# Altium schematic sheet CellsVoltMeasurementSensor.SchDoc
size A3; SheetNumber: 1; SheetTotal: 4
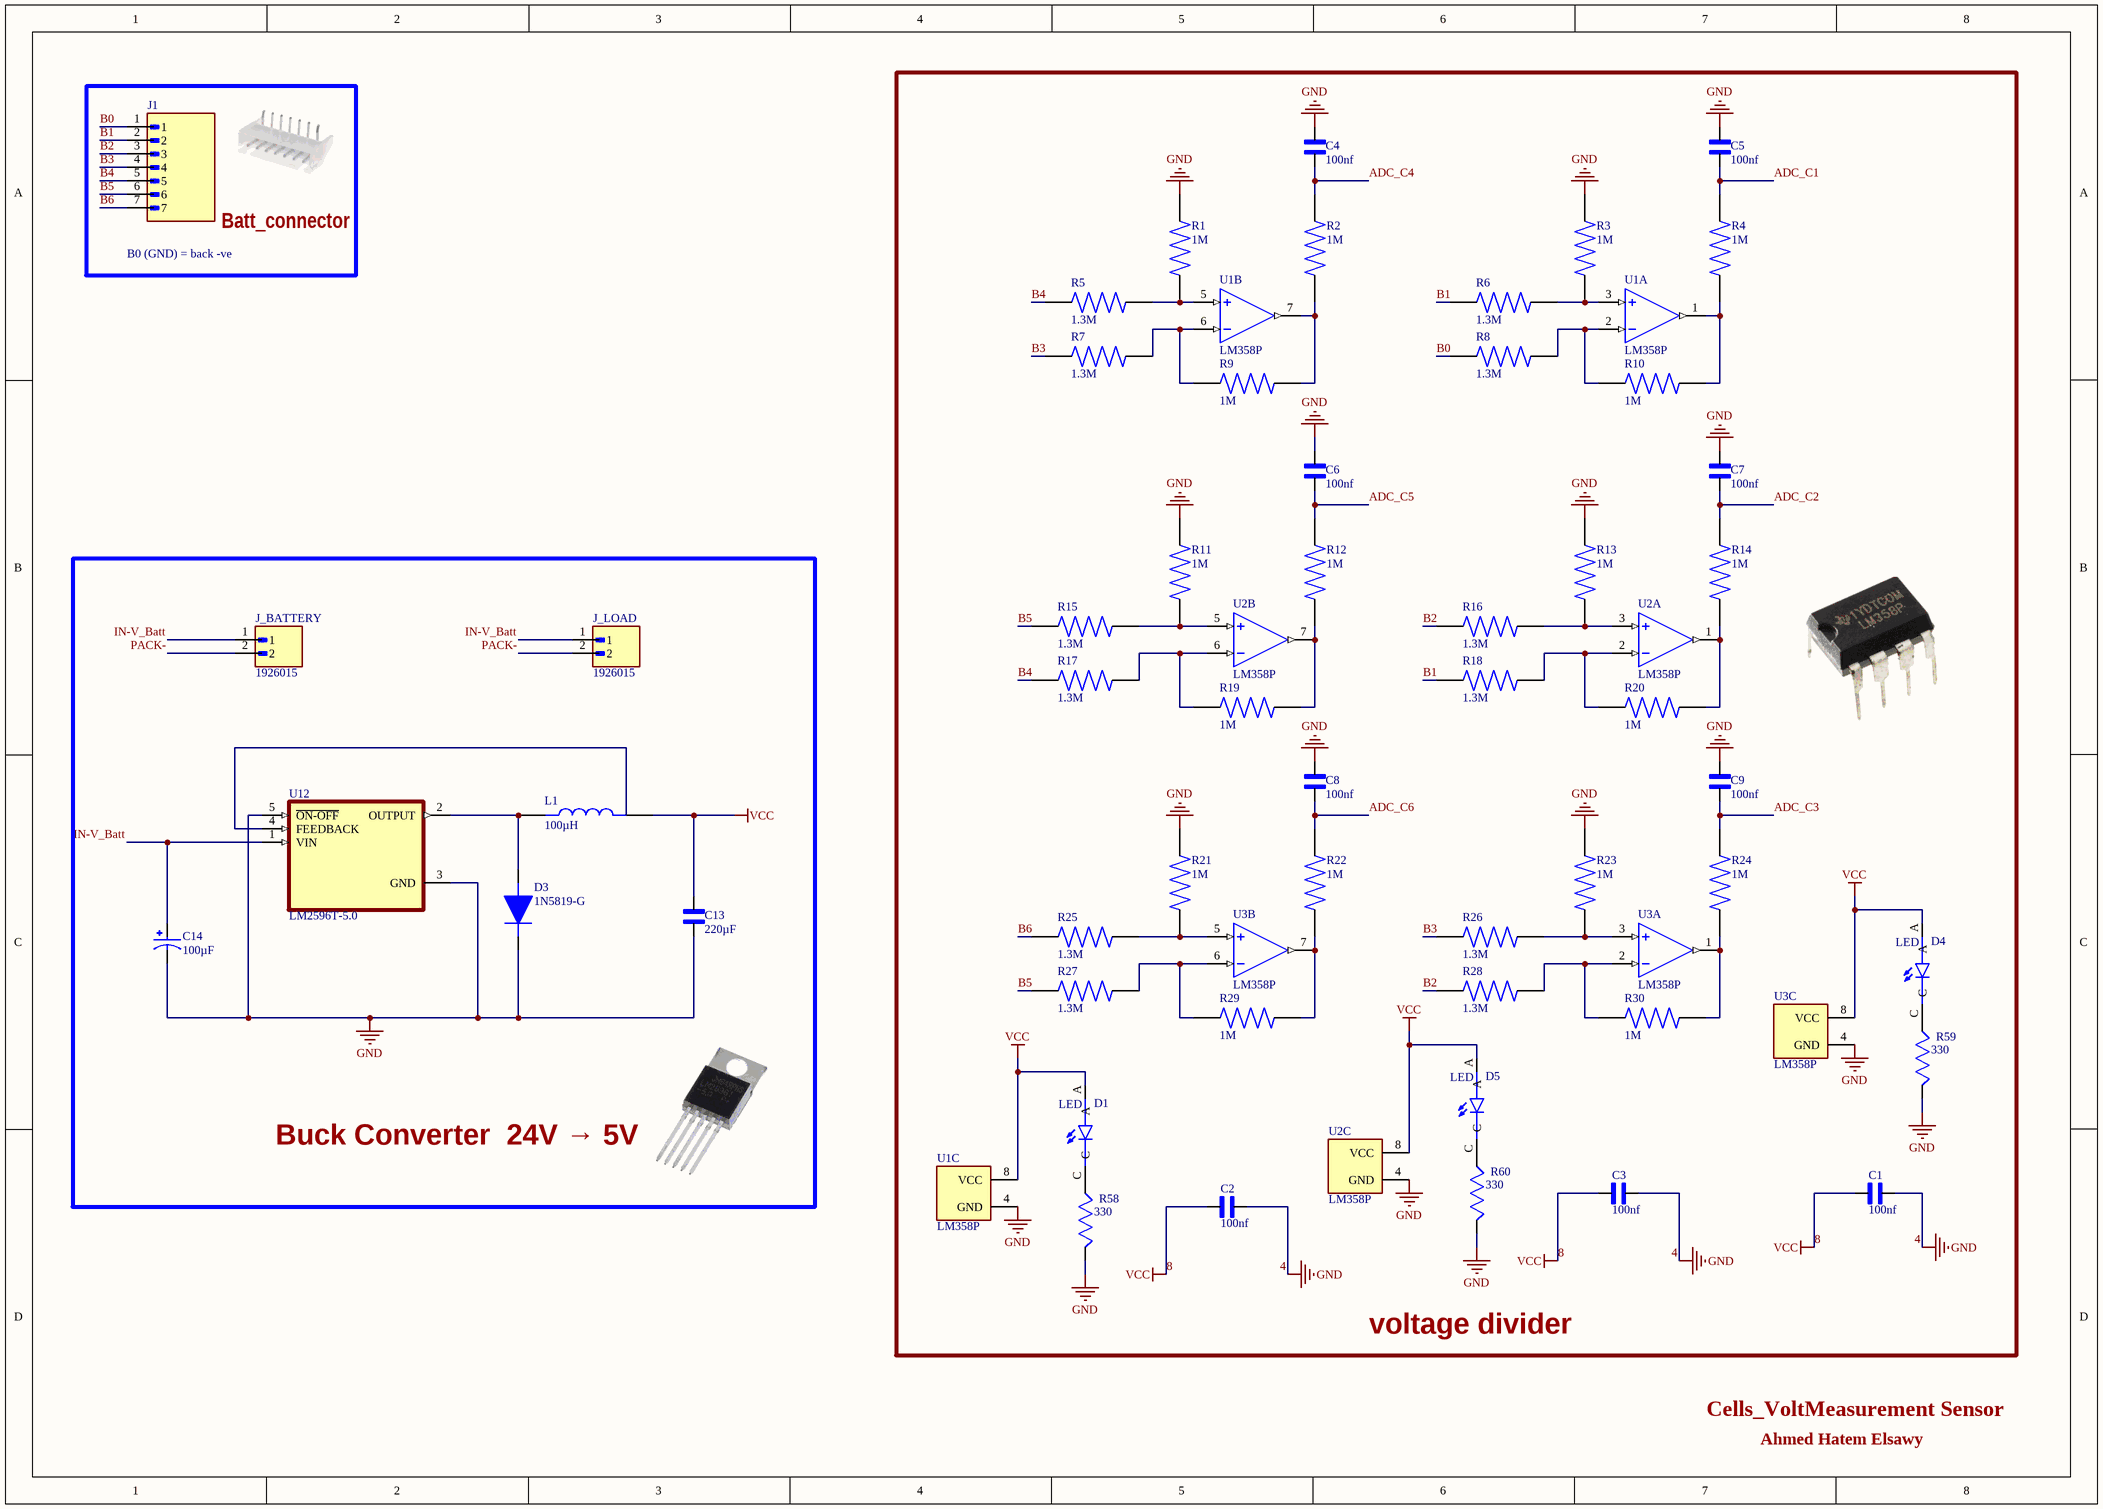
[diagram p0: CellsVoltMeasurementSensor.SchDoc]

## Parts
C1  100nf  [CAPC1608X90N]
C2  100nf  [CAPC1608X90N]
C3  100nf  [CAPC1608X90N]
C4  100nf  [CAPC1608X90N]
C5  100nf  [CAPC1608X90N]
C6  100nf  [CAPC1608X90N]
C7  100nf  [CAPC1608X90N]
C8  100nf  [CAPC1608X90N]
C9  100nf  [CAPC1608X90N]
C13  220µF  [CAPPM7343X310N]
C14  100µF  [CAP_EEEFN1E101UP]
D1  LED  [LED_WP7113ID]
D3  1N5819-G  [DIOAD1405W75L465D235]
D4  LED  [LED_WP7113ID]
D5  LED  [LED_WP7113ID]
J1  S7B-XH-A(LF)(SN)  [JST_S7B-XH-A(LF)(SN)]  (value not drawn)
J_BATTERY  1926015  [PHOENIX_1926015]
J_LOAD  1926015  [PHOENIX_1926015]
L1  100µH  [INDC2012X145N]
R1  1M  [RESC3216X75N]
R2  1M  [RESC3216X75N]
R3  1M  [RESC3216X75N]
R4  1M  [RESC3216X75N]
R5  1.3M  [RESC5025X70N]
R6  1.3M  [RESC5025X70N]
R7  1.3M  [RESC5025X70N]
R8  1.3M  [RESC5025X70N]
R9  1M  [RESC3216X75N]
R10  1M  [RESC3216X75N]
R11  1M  [RESC3216X75N]
R12  1M  [RESC3216X75N]
R13  1M  [RESC3216X75N]
R14  1M  [RESC3216X75N]
R15  1.3M  [RESC5025X70N]
R16  1.3M  [RESC5025X70N]
R17  1.3M  [RESC5025X70N]
R18  1.3M  [RESC5025X70N]
R19  1M  [RESC3216X75N]
R20  1M  [RESC3216X75N]
R21  1M  [RESC3216X75N]
R22  1M  [RESC3216X75N]
R23  1M  [RESC3216X75N]
R24  1M  [RESC3216X75N]
R25  1.3M  [RESC5025X70N]
R26  1.3M  [RESC5025X70N]
R27  1.3M  [RESC5025X70N]
R28  1.3M  [RESC5025X70N]
R29  1M  [RESC3216X75N]
R30  1M  [RESC3216X75N]
R58  330  [RESC3216X65]
R59  330  [RESC3216X65]
R60  330  [RESC3216X65]
U1  LM358P  [DIP794W45P254L959H508Q8]  (parts A,B,C of 3)
U2  LM358P  [DIP794W45P254L959H508Q8]  (parts A,B,C of 3)
U3  LM358P  [DIP794W45P254L959H508Q8]  (parts A,B,C of 3)
U12  LM2596T-5.0  [TO170P1016X470X2092-5]

## Blocks framed on the sheet
Batt_connector: J1
voltage divider: C1-C9 D1 D4 D5 R1-R30 R58-R60 U1-U3
Buck Converter  24V → 5V: C13 C14 D3 J_BATTERY J_LOAD L1 U12

## Nets
4: C1.1 C2.1 C3.1 C4.2 C5.2 C6.2 C7.2 C8.2 C9.2 C13.1 C14.2 D3.1(K) R1.2 R3.2 R11.2 R13.2 R21.2 R23.2 R58.1 R59.1 R60.1 U1.4(GND) U2.4(GND) U3.4(GND) U12.3(GND) U12.5(~{ON-OFF})  [also labelled GND]
8: C1.2 C2.2 C3.2 C13.2 D1.A D4.A D5.A L1.2 U1.8(VCC) U2.8(VCC) U3.8(VCC)  [also labelled VCC]
ADC_C1: C5.1 R4.2
ADC_C2: C7.1 R14.2
ADC_C3: C9.1 R24.2
ADC_C4: C4.1 R2.2
ADC_C5: C6.1 R12.2
ADC_C6: C8.1 R22.2
B0: J1.1 R8.1
B1: J1.2 R6.1 R18.1
B2: J1.3 R16.1 R28.1
B3: J1.4 R7.1 R26.1
B4: J1.5 R5.1 R17.1
B5: J1.6 R15.1 R27.1
B6: J1.7 R25.1
IN-V_Batt: C14.1 J_BATTERY.1 J_LOAD.1 U12.1(VIN)
PACK-: J_BATTERY.2 J_LOAD.2
NetD1_C: D1.C R58.2
NetD3_2: D3.2(A) L1.1 U12.2(OUTPUT)
NetD4_C: D4.C R59.2
NetD5_C: D5.C R60.2
NetR1_1: R1.1 R5.2 U1.5(+IN2)
NetR2_1: R2.1 R9.2 U1.7(OUT2)
NetR3_1: R3.1 R6.2 U1.3(+IN1)
NetR4_1: R4.1 R10.2 U1.1(OUT1)
NetR7_2: R7.2 R9.1 U1.6(-IN2)
NetR8_2: R8.2 R10.1 U1.2(-IN1)
NetR11_1: R11.1 R15.2 U2.5(+IN2)
NetR12_1: R12.1 R19.2 U2.7(OUT2)
NetR13_1: R13.1 R16.2 U2.3(+IN1)
NetR14_1: R14.1 R20.2 U2.1(OUT1)
NetR17_2: R17.2 R19.1 U2.6(-IN2)
NetR18_2: R18.2 R20.1 U2.2(-IN1)
NetR21_1: R21.1 R25.2 U3.5(+IN2)
NetR22_1: R22.1 R29.2 U3.7(OUT2)
NetR23_1: R23.1 R26.2 U3.3(+IN1)
NetR24_1: R24.1 R30.2 U3.1(OUT1)
NetR27_2: R27.2 R29.1 U3.6(-IN2)
NetR28_2: R28.2 R30.1 U3.2(-IN1)

Not connected (* = marked no-connect by the designer): U12 4(FEEDBACK)

## Notes on the sheet
- (near J1) B0 (GND) = back -ve
- Cells_VoltMeasurement Sensor
- Ahmed Hatem Elsawy

## Library data of the parts
C1-C9 = 06035C104K4T2A: Capacitor MLCC 0603 100nF 50V | AVX 06035C104K4T2A; SnapEDA_Link: https://www.snapeda.com/parts/06035C104K4T2A/AVX/view-part/?ref=snap; Package: 1608 AVX; Value: *; MF: AVX; MP: 06035C104K4T2A; Check_prices: https://www.snapeda.com/parts/06035C104K4T2A/AVX/view-part/?ref=eda
C13 = 593D227X9010E2TE3: Capacitor;Tantalum;220uF;Tol 10%;SMT;Vol-Rtg 10V;Size 7343-43 | Sprague / Vishay 593D227X9010E2TE3; MF: Vishay Sprague; SnapEDA_Link: https://www.snapeda.com/parts/593D227X9010E2TE3/Vishay/view-part/?ref=snap; Package: 2917 Vishay; Value: *; MP: 593D227X9010E2TE3; Check_prices: https://www.snapeda.com/parts/593D227X9010E2TE3/Vishay/view-part/?ref=eda
C14 = EEEFN1E101UP: CAP ALUM 100UF 20% 25V SMD; MF: Panasonic; SnapEDA_Link: https://www.snapeda.com/parts/EEEFN1E101UP/Panasonic/view-part/?ref=snap; Package: RADIAL-2 Panasonic; Value: *; MP: EEEFN1E101UP; Check_prices: https://www.snapeda.com/parts/EEEFN1E101UP/Panasonic/view-part/?ref=eda
D1 D4 D5 = WP7113ID: Red 617nm LED Indication - Discrete 2V Radial; MF: Kingbright; Price: None; MP: WP7113ID; Package: Radial Kingbright; Check_prices: https://www.snapeda.com/parts/WP7113ID/Kingbright/view-part/?ref=eda; Purchase-URL: https://pricing.snapeda.com/search/part/WP7113ID/?ref=eda; Availability: In Stock; Value: *; SnapEDA_Link: https://www.snapeda.com/parts/WP7113ID/Kingbright/view-part/?ref=snap
D3 = 1N5819-G: Diode,Schottky Barrier,Vr 40V,If 1A,Pkg CASE 59-10,Vf 0.6V,Tj +125degc,Cs 25A | ON Semiconductor 1N5819G; SnapEDA_Link: https://www.snapeda.com/parts/1N5819G/Onsemi/view-part/?ref=snap; Package: DO-41 onsemi; Value: *; MF: ON Semiconductor; MP: 1N5819G; Check_prices: https://www.snapeda.com/parts/1N5819G/Onsemi/view-part/?ref=eda
J1 = S7B-XH-A(LF)(SN): Connector Header Through Hole, Right Angle 7 position 0.098 (2.50mm); MF: JST Sales; SnapEDA_Link: https://www.snapeda.com/parts/S7B-XH-A(LF)(SN)/JST/view-part/?ref=snap; Package: None; Value: *; MP: S7B-XH-A(LF)(SN); Check_prices: https://www.snapeda.com/parts/S7B-XH-A(LF)(SN)/JST/view-part/?ref=eda
L1 = MLF2012C101MTD25: 100ÂµH Shielded Multilayer Inductor 2mA 3.1Ohm Max 0805 (2012 Metric); MF: TDK; SnapEDA_Link: https://www.snapeda.com/parts/MLF2012C101MTD25/TDK/view-part/?ref=snap; Package: 0805 TDK Corporation; Value: *; MP: MLF2012C101MTD25; Check_prices: https://www.snapeda.com/parts/MLF2012C101MTD25/TDK/view-part/?ref=eda
R1-R4 R9-R14 R19-R24 R29 R30 = CR1206-FX-1004ELF: Res 1206 1M 1% 250mW | Bourns CR1206-FX-1004ELF; SnapEDA_Link: https://www.snapeda.com/parts/CR1206-FX-1004ELF/Bourns/view-part/?ref=snap; Package: 3216 Bourns; Value: *; MF: Bourns; MP: CR1206-FX-1004ELF; Check_prices: https://www.snapeda.com/parts/CR1206-FX-1004ELF/Bourns/view-part/?ref=eda
R5-R8 R15-R18 R25-R28 = ERJ-12ZYJ135U: Res Thick Film 2010 1.3M Ohm 5% 3/4W -400ppm/Â°C to 150ppm/Â°C Molded SMD SMD Embossed Carrier T/R; MF: Panasonic; SnapEDA_Link: https://www.snapeda.com/parts/ERJ-12ZYJ135U/Panasonic/view-part/?ref=snap; Package: 5025 Panasonic Electronic Components; Value: *; MP: ERJ-12ZYJ135U; Check_prices: https://www.snapeda.com/parts/ERJ-12ZYJ135U/Panasonic/view-part/?ref=eda
R58-R60 = RC1206JR-13330RL: Res Thick Film 1206 330 Ohm 5% 0.25W(1/4W) Â±100ppm/Â°C Epoxy Pad SMD T/R; MF: Yageo Corporation; MP: RC1206JR13330RL; SnapEDA_Link: https://www.snapeda.com/parts/RC1206JR13330RL/Yageo/view-part/?ref=snap; Package: 1206-2 YAGEO; Value: *; Check_prices: https://www.snapeda.com/parts/RC1206JR13330RL/Yageo/view-part/?ref=eda
U1-U3 = LM358P: Dual, 30-V, 700-kHz operational amplifier; MF: Texas Instruments; SnapEDA_Link: https://www.snapeda.com/parts/LM358P/Texas+Instruments/view-part/?ref=snap; Package: PDIP-8 Texas; Value: *; MP: LM358P; Check_prices: https://www.snapeda.com/parts/LM358P/Texas+Instruments/view-part/?ref=eda
U12 = LM2596T-5.0: SIMPLE SWITCHERÂ® 4.5V to 40V, 3A Low Component Count Step-Down Regulator 5-TO-220; MF: Texas Instruments; SnapEDA_Link: https://www.snapeda.com/parts/LM2596T-5.0/Texas+Instruments/view-part/?ref=snap; Package: TO-220-5 Texas Instruments; Value: *; MP: LM2596T-5.0; Check_prices: https://www.snapeda.com/parts/LM2596T-5.0/Texas+Instruments/view-part/?ref=eda
J_BATTERY J_LOAD = 1926015: Package: None; Price: None; Value: *; MP: 1926015; Availability: Unavailable